# EAGLE design FlexPCB_Compact (EAGLE 9.6.2)
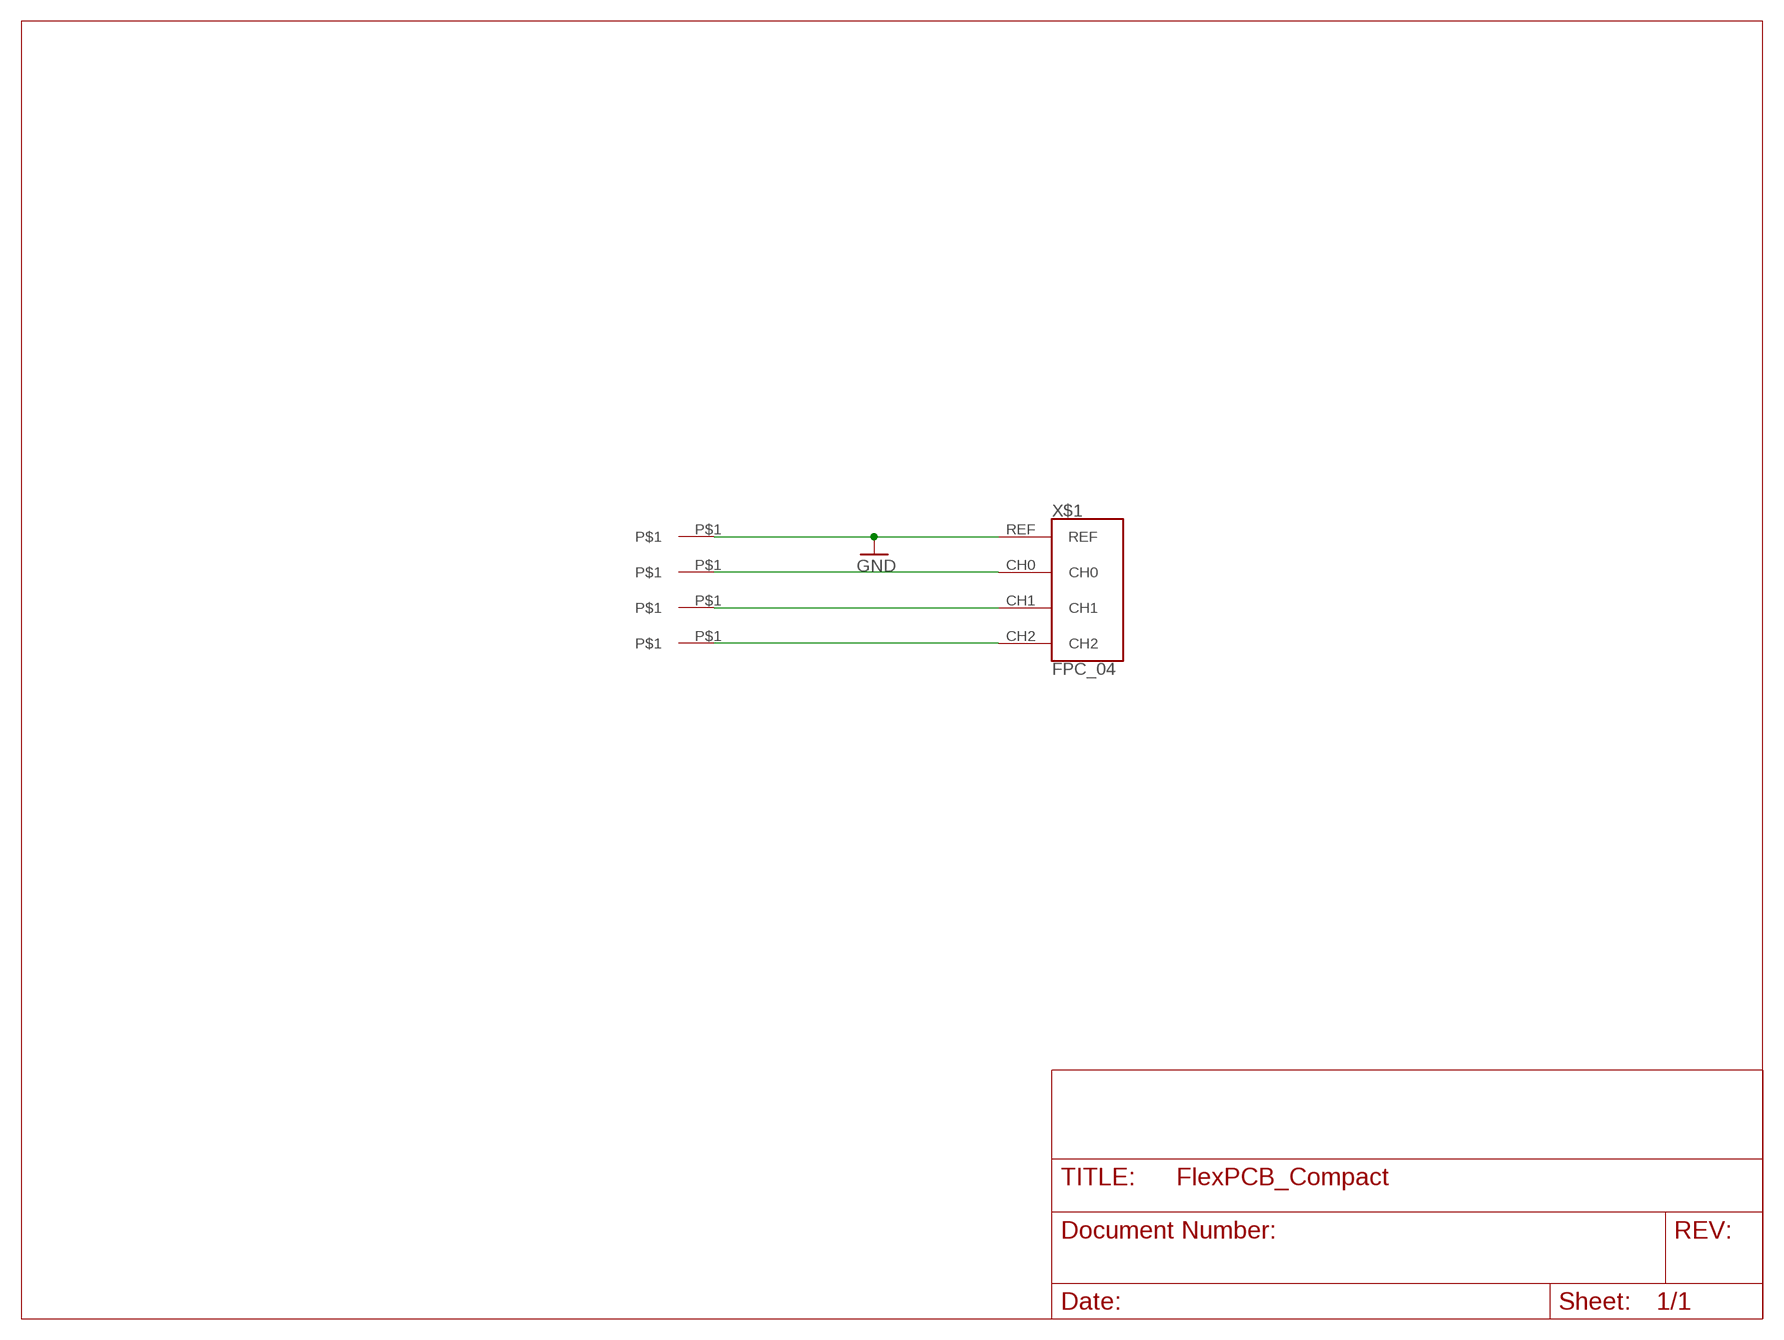
[diagram p0: schematic, sheet 1]

## Parts
CH0  CONN  [CONN]
CH1  CONN  [CONN]
CH2  CONN  [CONN]
REF  CONN  [CONN]
X$1  FPC_04  [FPC_04]

## Nets
GND: REF.P$1 X$1.REF
N$2: CH0.P$1 X$1.CH0
N$3: CH1.P$1 X$1.CH1
N$4: CH2.P$1 X$1.CH2

## Library data of the parts
CH0 CH1 CH2 REF = IonSensor:CONN
X$1 = IonSensor:FPC_04: FPC Connector for Ion Sensor

## Net classes
0 default: width 0.305 mm

## Board
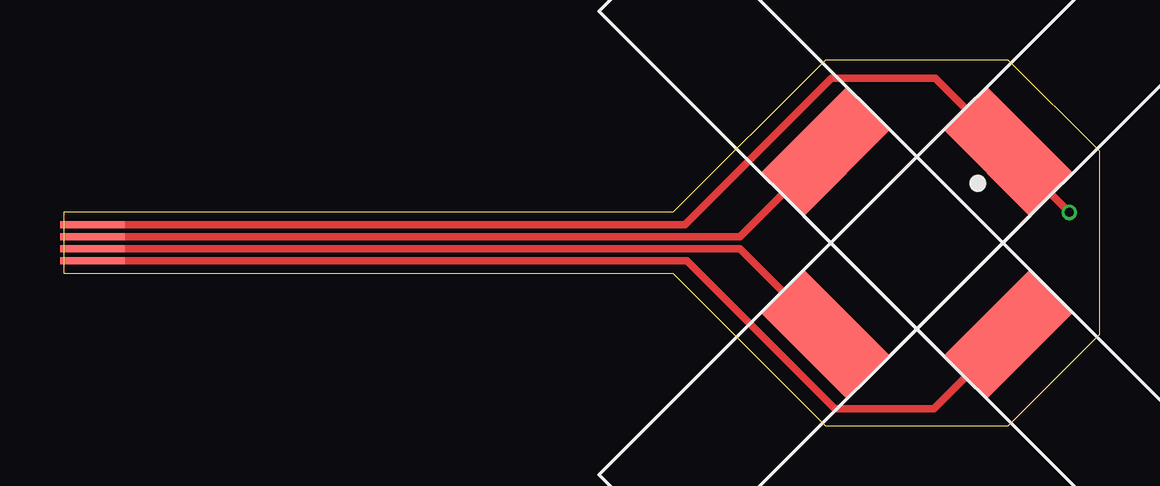
[diagram p1: board, top side]
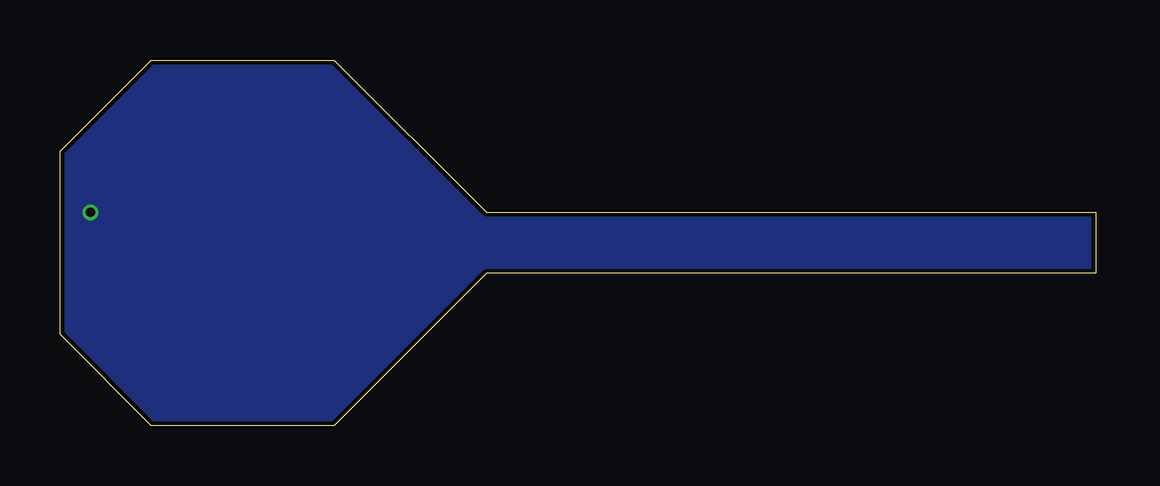
[diagram p2: board, bottom side, seen from below]

Size 43.18 x 15.24 mm. Coordinates in mm from the lower left corner, seen from the top.
Outline: 0,6.35 25.4,6.35 31.75,0 39.37,0 43.18,3.81 43.18,11.43 39.37,15.24 31.75,15.24 25.4,8.89 0,8.89 0,6.35
Copper layers (1*16): Top 0.035mm / dielectric 1.5mm / Bottom 0.035mm
Design rules "SparkFun-2-Layer-Minimum-JLCPCB": minimum track width 5mil, minimum drill 0.3mm, track to track 5mil, track to pad 5mil, pad to pad 5mil, via to via 5mil, smd to smd 5mil, copper to edge 7mil, drill to drill 7mil, minimum pad ring 5mil, minimum via ring 5mil, stop-mask expansion 2.5mil, vias tented up to drill 25mil, thermal gap 10mil

### Footprints (pad centres in the part's own frame; a part is rotated, then mirrored left to right if it is on the bottom)
CONN = smd 5.08 x 2.54: P$1 0,0
FPC_04 = smd 2.7 x 0.3: CH0 -1.35,0.25; CH1 -1.35,-0.25; CH2 -1.35,-0.75; REF -1.35,0.75

### Placement (x,y rotation side)
CH0  31.75,11.43 45 top
CH1  31.75,3.81 135 top
CH2  39.37,3.81 225 top
REF  39.37,11.43 315 top
X$1  2.54,7.62 0 top

### Tracks (layer width: path | path; a pad name or v marks a point on that pad's centre or on a via)
GND  (via drill 0.38)
  Top 0.305: X$1.REF 25.9,8.37 32,14.48 36.32,14.48 REF.P$1 v41.91,8.89
  pour Bottom (no thermals): -1.27,-1.27 45.72,-1.27 45.72,17.78 -1.27,17.78
N$2
  Top 0.305: X$1.CH0 28.19,7.87 CH0.P$1
N$3
  Top 0.305: X$1.CH1 28.19,7.37 CH1.P$1
N$4
  Top 0.305: X$1.CH2 25.98,6.87 32.14,0.71 36.27,0.71 CH2.P$1

### Text on the board
tPlace: •